# EAGLE schematic attiny_x4_blink (EAGLE 9.3.0)
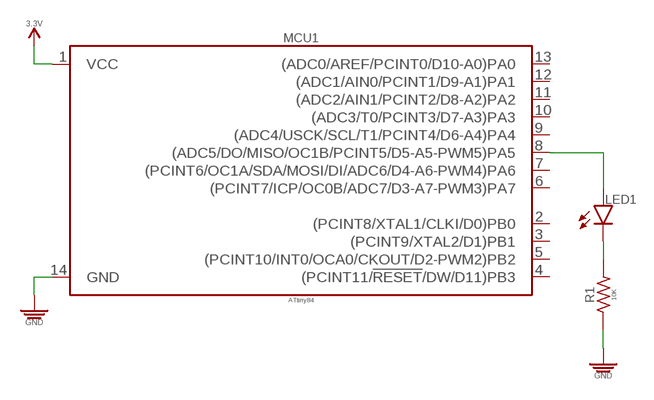
[diagram p0: schematic, sheet 1]

## Parts
LED1  LED_PTH_T-1_3/4_5MM_NO-COLOR  [LED_PTH_T-1_3/4_5MM]
MCU1  ATtiny84  ATTINY-X4_DIP-14_ATTINY-84_CONNECTOR  [DIP794W46P254L1919H533Q14B_DIP-14_CONNECTOR]
R1  10K  10KΩ_PTH-204/7_1/6W-5%  [RESAD660W45L340D190B]

## Nets
3.3V: MCU1.1(VCC)
GND: MCU1.14(GND) R1.1
N$1: LED1.A MCU1.8((ADC5/DO/MISO/OC1B/PCINT5/D5-A5-PWM5)PA5)
N$2: LED1.K R1.2
Unconnected: MCU1.2((PCINT8/XTAL1/CLKI/D0)PB0) MCU1.3((PCINT9/XTAL2/D1)PB1) MCU1.4((PCINT11/!RESET!/DW/D11)PB3) MCU1.5((PCINT10/INT0/OCA0/CKOUT/D2-PWM2)PB2) MCU1.6((PCINT7/ICP/OC0B/ADC7/D3-A7-PWM3)PA7) MCU1.7((PCINT6/OC1A/SDA/MOSI/DI/ADC6/D4-A6-PWM4)PA6) MCU1.9((ADC4/USCK/SCL/T1/PCINT4/D6-A4)PA4) MCU1.10((ADC3/T0/PCINT3/D7-A3)PA3) MCU1.11((ADC2/AIN1/PCINT2/D8-A2)PA2) MCU1.12((ADC1/AIN0/PCINT1/D9-A1)PA1) MCU1.13((ADC0/AREF/PCINT0/D10-A0)PA0)

## Library data of the parts
LED1 = _leds:LED
MCU1 = _ic_microcontrollers:ATTINY-X4; DATASHEET: ATTINY24A,44A,84A Complete; DATASHEET_CONNECTOR: http://www.assmann-wsw.com/fileadmin/datasheets/ASS_0810_CO.pdf; DIST: Digikey; DISTLINK: https://www.digikey.com/products/en?keywords=ATTINY84A-PU-ND; DISTLINK_CONNECTOR: https://www.digikey.com/products/en?keywords=AE9989-ND; DISTPN: ATTINY84A-PU-ND; DISTPN_CONNECTOR: AE9989-ND; DIST_CONNECTOR: Digikey; MFR: Microchip Technology; MFR_CONNECTOR: Assmann WSW Components; MPN: ATTINY84A-PU; MPN_CONNECTOR: A 14-LC-TT
R1 = _resistors:10KΩ; DATASHEET: http://www.yageo.com/NewPortal/yageodocoutput?fileName=/pdf/throughhole/Yageo_LR_CFR_2013.pdf; DIST: Digikey; DISTLINK: https://www.digikey.com/products/en?keywords=CFR-12JB-52-10K; DISTPN: 10KEBK-ND; MFR: Yageo; MPN: CFR-12JB-52-10K